# EasyEDA Pro project TeensySensorV6.1.eprj, board PCB1
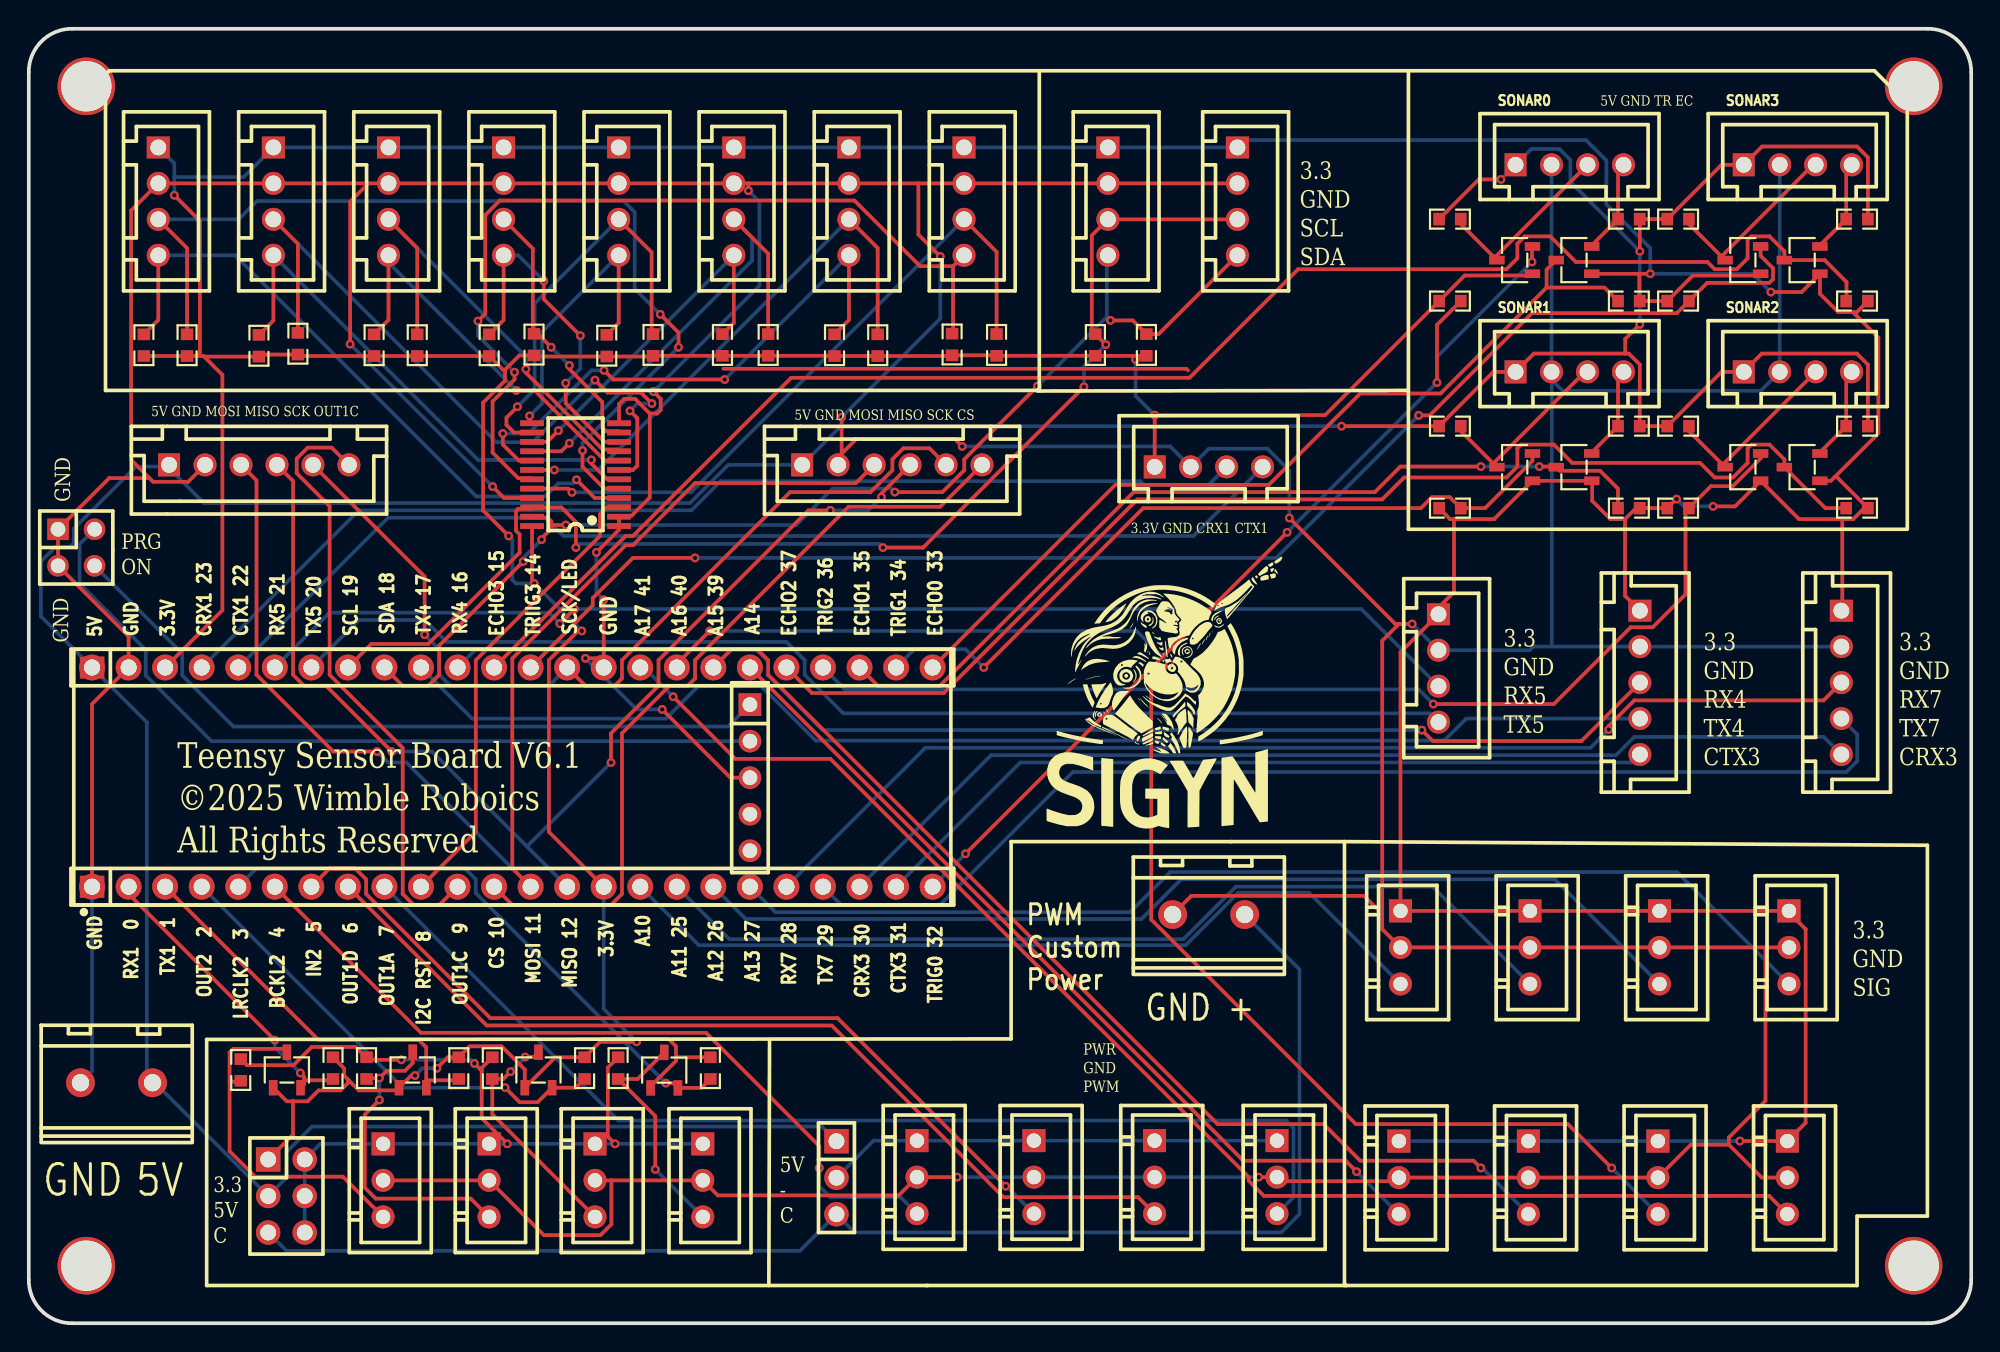
[diagram p5: board, top side]
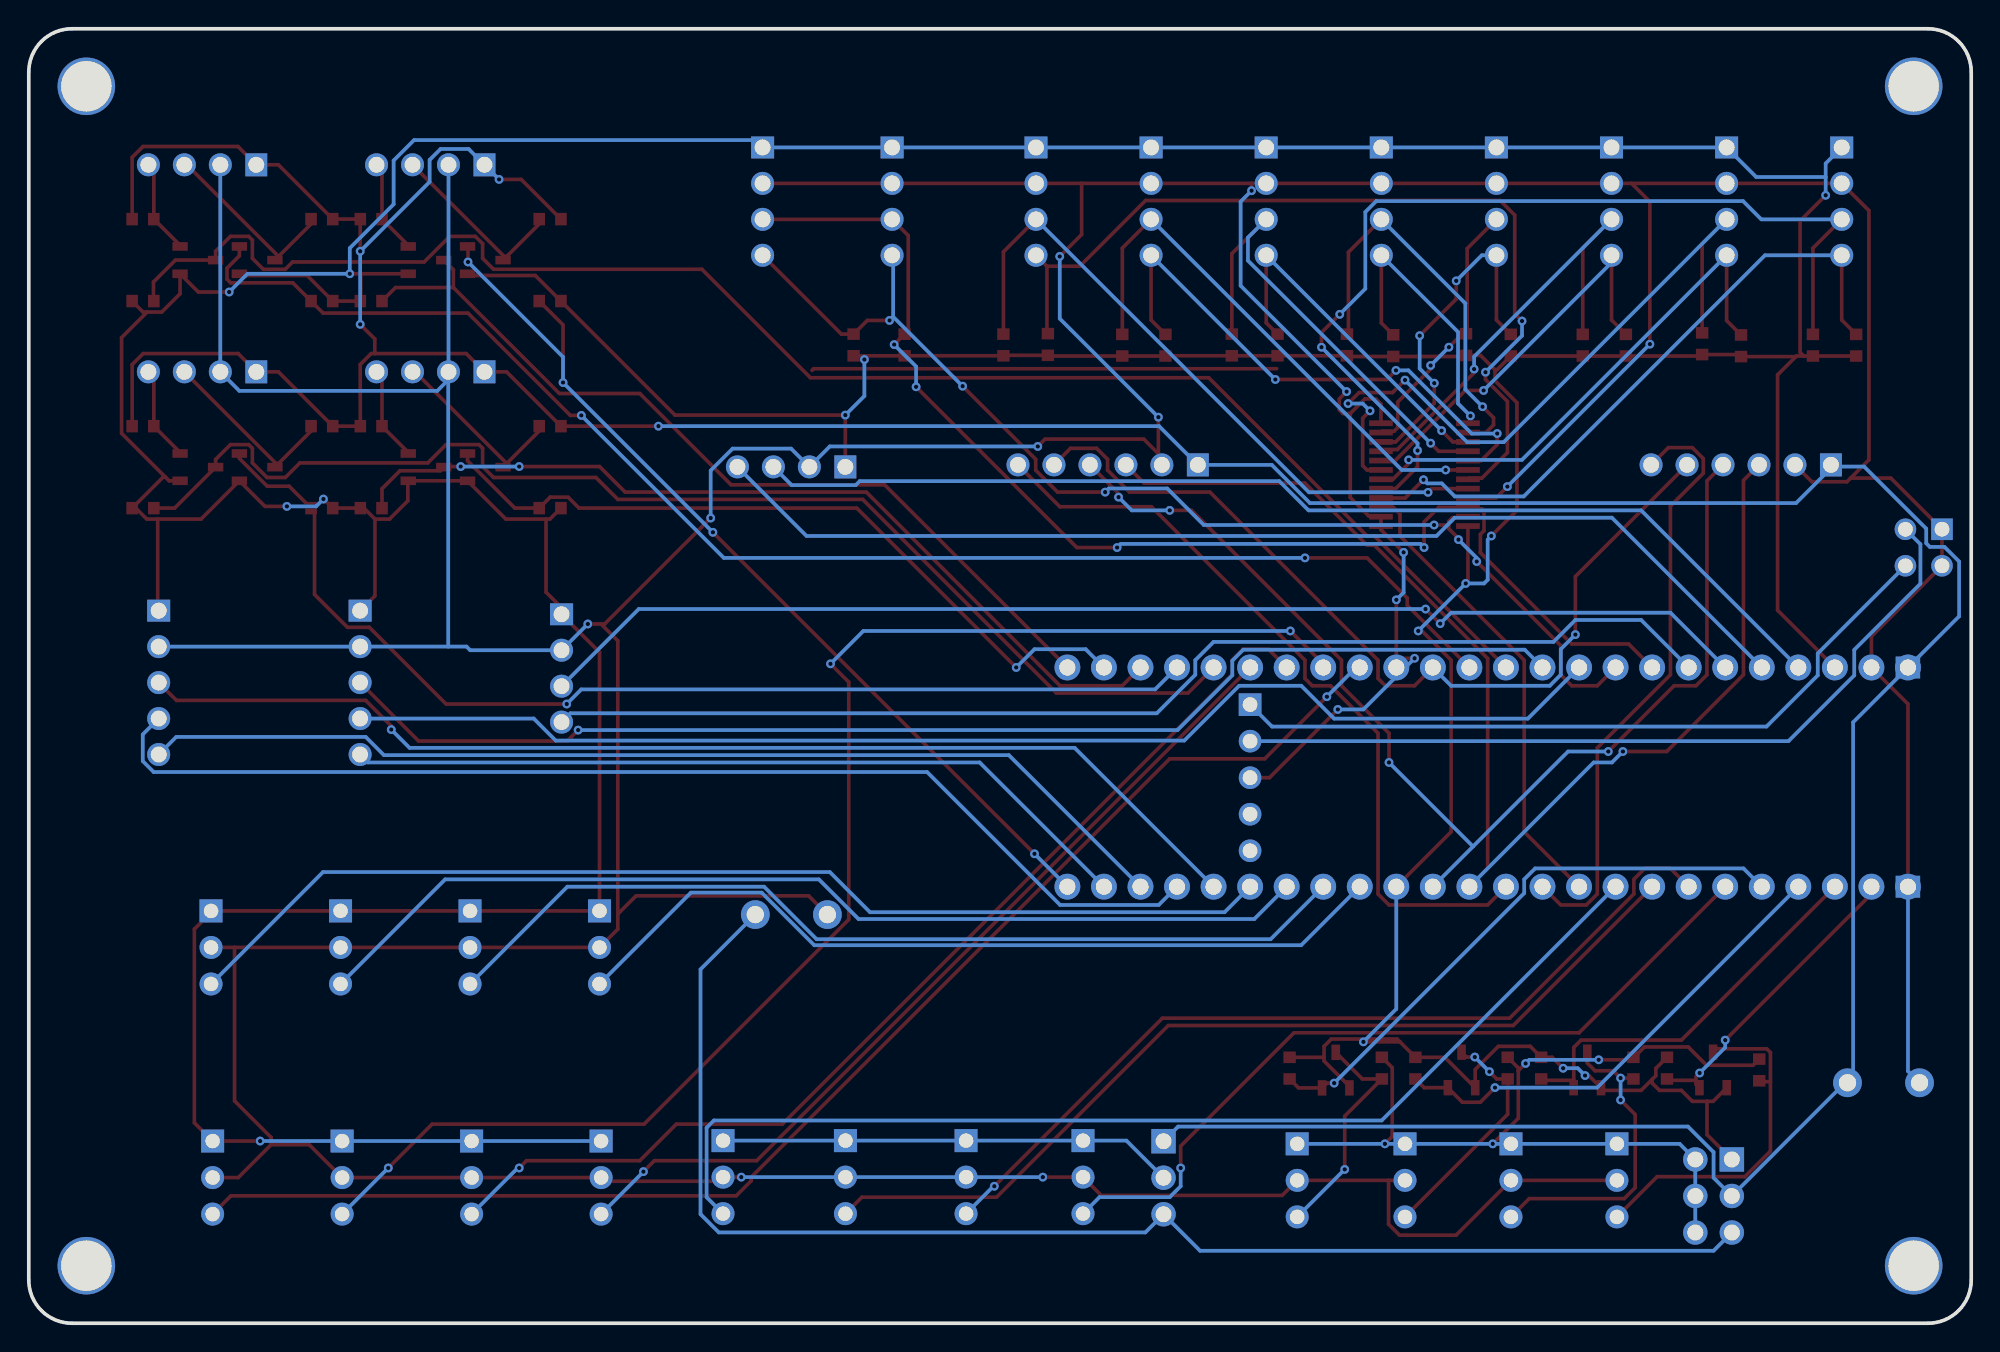
[diagram p6: board, bottom side, seen from below]

Outline 135 x 90 mm; copper layers: Top Layer, Inner1, Inner2, Bottom Layer. Coordinates in mm from the lower left corner of the outline.
Outline path: 0,87 0,3 arc(0.88,0.88) 3,0 132,0 arc(134.12,0.88) 135,3 135,87 arc(134.12,89.12) 132,90 3,90 arc(0.88,89.12) 0,87
Stack: Top Layer 0.035mm Outer layer thickness 1oz / Dielectric1 0.2104mm 7628 RC49% 8.6mil / Inner1 0.0152mm Inner layer thickness / Dielectric2 1.065mm 1.1mm H/HOZ Copper / Inner2 0.0152mm Inner layer thickness / Dielectric3 0.2104mm 7628 RC49% 8.6mil / Bottom Layer 0.035mm Outer layer thickness 1oz

## Design rules (mm)
template: JLCPCB Capability(Two Layers Board)
spacing copperThickness1oz (default): track to track 0.102, other pairs 0.152 to 0.3
spacing copperThickness2oz: track to track 0.203, other pairs 0.152 to 0.3
track width copperThickness1oz (default): min 0.127, default 0.254, max 2.54
track width copperThickness2oz: min 0.203, default 0.254, max 2.54
differential pair differentialPair (default): width min 0.127, default 0.254, max 2.54; gap min 0.152, default 0.152
via viaSize (default): diameter min 0.5, default 0.61, max 10; hole min 0.3, default 0.305, max 6.3

## Placement (name value [footprint] x y rotation side)
CN1  ZX-XH2.54-3PZZ  [CONN-TH_3P-P2.54_2501S-3P]  46.84 9.93 270 top
CN2  ZX-XH2.54-3PZZ  [CONN-TH_3P-P2.54_2501S-3P]  39.35 9.93 270 top
CN3  ZX-XH2.54-3PZZ  [CONN-TH_3P-P2.54_2501S-3P]  24.62 9.93 270 top
CN10  ZX-XH2.54-4PZZ  [CONN-TH_4P-P2.50_4PIN]  82 59.54 0 top
CN11  ZX-XH2.54-4PZZ  [CONN-TH_4P-P2.50_4PIN]  75 78 270 top
CN12  ZX-XH2.54-4PZZ  [CONN-TH_4P-P2.50_4PIN]  84 78 270 top
CN13  ZX-XH2.54-4PZZ  [CONN-TH_4P-P2.50_4PIN]  97.97 45.54 270 top
CN14  ZX-XH2.54-4PZZ  [CONN-TH_4P-P2.50_4PIN]  9 78 270 top
CN15  ZX-XH2.54-4PZZ  [CONN-TH_4P-P2.50_4PIN]  17 78 270 top
CN16  ZX-XH2.54-4PZZ  [CONN-TH_4P-P2.50_4PIN]  25 78 270 top
CN17  ZX-XH2.54-4PZZ  [CONN-TH_4P-P2.50_4PIN]  33 78 270 top
CN18  ZX-XH2.54-4PZZ  [CONN-TH_4P-P2.50_4PIN]  41 78 270 top
CN19  ZX-XH2.54-4PZZ  [CONN-TH_4P-P2.50_4PIN]  49 78 270 top
CN20  ZX-XH2.54-4PZZ  [CONN-TH_4P-P2.50_4PIN]  57 78 270 top
CN21  ZX-XH2.54-4PZZ  [CONN-TH_4P-P2.50_4PIN]  65 78 270 top
CN50  ZX-XH2.54-3PZZ  [CONN-TH_3P-P2.54_2501S-3P]  61.73 10.16 270 top
CN51  ZX-XH2.54-3PZZ  [CONN-TH_3P-P2.54_2501S-3P]  69.86 10.16 270 top
CN52  ZX-XH2.54-3PZZ  [CONN-TH_3P-P2.54_2501S-3P]  78.24 10.16 270 top
CN53  ZX-XH2.54-3PZZ  [CONN-TH_3P-P2.54_2501S-3P]  86.75 10.16 270 top
CN54  ZX-XH2.54-3PZZ  [CONN-TH_3P-P2.54_2501S-3P]  31.99 9.93 270 top
CN56  ZX-XH2.54-3PZZ  [CONN-TH_3P-P2.54_2501S-3P]  122.22 10.13 270 top
CN57  ZX-XH2.54-3PZZ  [CONN-TH_3P-P2.54_2501S-3P]  113.22 10.13 270 top
CN58  ZX-XH2.54-3PZZ  [CONN-TH_3P-P2.54_2501S-3P]  104.22 10.13 270 top
CN59  ZX-XH2.54-3PZZ  [CONN-TH_3P-P2.54_2501S-3P]  95.22 10.13 270 top
CN60  ZX-XH2.54-3PZZ  [CONN-TH_3P-P2.54_2501S-3P]  122.33 26.13 270 top
CN61  ZX-XH2.54-3PZZ  [CONN-TH_3P-P2.54_2501S-3P]  113.33 26.13 270 top
CN62  ZX-XH2.54-3PZZ  [CONN-TH_3P-P2.54_2501S-3P]  104.33 26.13 270 top
CN63  ZX-XH2.54-3PZZ  [CONN-TH_3P-P2.54_2501S-3P]  95.33 26.13 270 top
H1  PZ254V-11-03P  [HDR-TH_3P-P2.54-V-M]  56.13 10.12 270 top
H18  HX PZ2.54-2x2P ZZ  [HDR-TH_HX-PZ2.54-2X2P-ZZ]  3.3 53.93 270 top
P1  WJ127-5.0-2P  [CONN-TH_2P-P5.00_CPC3703CTR]  6.1 16.72 0 top
P2  WJ127-5.0-2P  [CONN-TH_2P-P5.00_CPC3703CTR]  82 28.41 0 top
Q1  BSS138  [SOT-23-3_L2.9-W1.6-P1.90-LS2.8-BR]  103.27 73.92 0 top
Q2  BSS138  [SOT-23-3_L2.9-W1.6-P1.90-LS2.8-BR]  107.39 73.92 0 top
Q3  BSS138  [SOT-23-3_L2.9-W1.6-P1.90-LS2.8-BR]  103.27 59.52 0 top
Q4  BSS138  [SOT-23-3_L2.9-W1.6-P1.90-LS2.8-BR]  107.39 59.52 0 top
Q5  BSS138  [SOT-23-3_L2.9-W1.6-P1.90-LS2.8-BR]  119.13 59.52 0 top
Q6  BSS138  [SOT-23-3_L2.9-W1.6-P1.90-LS2.8-BR]  123.25 59.52 0 top
Q7  BSS138  [SOT-23-3_L2.9-W1.6-P1.90-LS2.8-BR]  119.13 73.92 0 top
Q8  BSS138  [SOT-23-3_L2.9-W1.6-P1.90-LS2.8-BR]  123.25 73.92 0 top
Q16  BSS138  [SOT-23-3_L2.9-W1.6-P1.90-LS2.8-BR]  44.17 17.6 270 top
Q19  BSS138  [SOT-23-3_L2.9-W1.6-P1.90-LS2.8-BR]  35.42 17.61 270 top
Q20  BSS138  [SOT-23-3_L2.9-W1.6-P1.90-LS2.8-BR]  26.68 17.61 270 top
Q21  BSS138  [SOT-23-3_L2.9-W1.6-P1.90-LS2.8-BR]  17.94 17.61 270 top
R1  3kΩ  [R0603]  8 68 90 top
R2  3kΩ  [R0603]  11 68 90 top
R3  3kΩ  [R0603]  16 67.96 90 top
R4  3kΩ  [R0603]  18.7 68.1 90 top
R5  3kΩ  [R0603]  24 68 90 top
R6  3kΩ  [R0603]  27 68 90 top
R7  3kΩ  [R0603]  32 68 90 top
R8  3kΩ  [R0603]  35.11 68.04 90 top
R9  3kΩ  [R0603]  67.26 68.02 270 top
R10  3kΩ  [R0603]  64.17 68.05 270 top
R11  3kΩ  [R0603]  59 68 270 top
R12  3kΩ  [R0603]  56 68 270 top
R13  3kΩ  [R0603]  51.39 68.02 270 top
R14  3kΩ  [R0603]  48.21 68.02 270 top
R15  3kΩ  [R0603]  43.39 68.02 270 top
R16  3kΩ  [R0603]  40.17 67.97 270 top
R17  3kΩ  [R0603]  74.13 68.01 270 top
R18  3kΩ  [R0603]  77.68 68.02 270 top
R19  10kΩ  [R0603]  98.77 76.77 0 top
R20  10kΩ  [R0603]  98.77 71.07 0 top
R21  10kΩ  [R0603]  111.21 76.77 0 top
R22  10kΩ  [R0603]  111.21 71.07 0 top
R23  10kΩ  [R0603]  98.77 62.37 0 top
R24  10kΩ  [R0603]  98.77 56.67 0 top
R25  10kΩ  [R0603]  111.21 62.37 0 top
R26  10kΩ  [R0603]  111.21 56.67 0 top
R27  10kΩ  [R0603]  114.63 62.37 0 top
R28  10kΩ  [R0603]  114.63 56.67 0 top
R29  10kΩ  [R0603]  127.06 62.37 0 top
R30  10kΩ  [R0603]  127.06 56.67 0 top
R31  10kΩ  [R0603]  114.63 76.77 0 top
R32  10kΩ  [R0603]  114.63 71.07 0 top
R33  10kΩ  [R0603]  127.06 76.77 0 top
R34  10kΩ  [R0603]  127.06 71.07 0 top
R39  10kΩ  [R0603]  47.37 17.74 90 top
R40  10kΩ  [R0603]  40.96 17.74 90 top
R41  10kΩ  [R0603]  38.63 17.74 90 top
R42  10kΩ  [R0603]  32.22 17.74 90 top
R43  10kΩ  [R0603]  29.89 17.74 90 top
R44  10kΩ  [R0603]  23.47 17.74 90 top
R45  10kΩ  [R0603]  21.14 17.74 90 top
R46  10kΩ  [R0603]  14.73 17.61 90 top
SONAR0  ZX-XH2.54-4PZZ  [CONN-TH_4P-P2.50_4PIN]  107.08 80.54 0 top
SONAR1  ZX-XH2.54-4PZZ  [CONN-TH_4P-P2.50_4PIN]  107.08 66.15 0 top
SONAR2  ZX-XH2.54-4PZZ  [CONN-TH_4P-P2.50_4PIN]  122.94 66.15 0 top
SONAR3  ZX-XH2.54-4PZZ  [CONN-TH_4P-P2.50_4PIN]  122.94 80.54 0 top
U1  Teensy USB Board, Version 4.1  [COMM-TH_L61.0-W17.8-P2.54]  33.61 37.97 0 top
U2  TCA9548APWR  [TSSOP-24_L7.8-W4.4-P0.65-LS6.4-BL]  38 59 90 top
U4  ZX-XH2.54-6PZZ  [CONN-TH_6P-P2.50_ZX-XH2.54-6PZZ]  60 59.68 180 top
U5  ZX-XH2.54-5PZZ  [CONN-TH_5P-P2.50_ZX-XH2.54-5PZZ]  125.97 44.54 270 top
U6  ZX-XH2.54-5PZZ  [CONN-TH_5P-P2.50_ZX-XH2.54-5PZZ]  111.97 44.54 270 top
U8  ZX-XH2.54-6PZZ  [CONN-TH_6P-P2.50_ZX-XH2.54-6PZZ]  16 59.68 180 top
U12  -  [3.5mm_Hole#2]  133.83 -4.84 0 top
U13  -  [3.5mm_Hole]  150.72 79.12 0 top
U14  -  [3.5mm_Hole#3]  -7.02 56.33 0 top
U15  -  [3.5mm_Hole#4]  -7.02 -9.71 0 top
U19  BX-PZ2.54-2-3PZZ  [HDR-TH_6P-P2.54-V-M-R2-C3-S2.54]  17.91 8.85 270 top
U43  HC-PM254-8.5H-1x24PZ  [HDR-TH_24P-P2.54-V-F]  33.61 45.59 0 top
U44  HC-PM254-8.5H-1x24PZ  [HDR-TH_24P-P2.54-V-F]  33.61 30.35 0 top
U48  PM2.54-1*5  [HDR-TH_5P-P2.54-V-F]  50.12 37.93 270 top

## Footprints (pads in the part's own frame, mm; a bottom-side part is the same pattern mirrored in y, then rotated)
3.5mm_Hole
  round 4 hole 3.5: 3(-19.717,6.877)
3.5mm_Hole#2
  round 4 hole 3.5: 3(-2.826,8.841)
3.5mm_Hole#3
  round 4 hole 3.5: 3(11.017,29.674)
3.5mm_Hole#4
  round 4 hole 3.5: 3(11.017,13.714)
COMM-TH_L61.0-W17.8-P2.54
  round 1.8 hole 1.1: 1(-29.21,-7.62) 2(-26.67,-7.62) 3(-24.13,-7.62) 4(-21.59,-7.62) 5(-19.05,-7.62) 6(-16.51,-7.62) 7(-13.97,-7.62) 8(-11.43,-7.62) 9(-8.89,-7.62) 10(-6.35,-7.62) 11(-3.81,-7.62) 12(-1.27,-7.62) 13(1.27,-7.62) 14(3.81,-7.62) 15(6.35,-7.62) 16(8.89,-7.62) 17(11.43,-7.62) 18(13.97,-7.62) 19(16.51,-7.62) 20(19.05,-7.62) 21(21.59,-7.62) 22(24.13,-7.62) 23(26.67,-7.62) 24(29.21,-7.62) 25(29.21,7.62) 26(26.67,7.62) 27(24.13,7.62) 28(21.59,7.62) 29(19.05,7.62) 30(16.51,7.62) 31(13.97,7.62) 32(11.43,7.62) 33(8.89,7.62) 34(6.35,7.62) 35(3.81,7.62) 36(1.27,7.62) 37(-1.27,7.62) 38(-3.81,7.62) 39(-6.35,7.62) 40(-8.89,7.62) 41(-11.43,7.62) 42(-13.97,7.62) 43(-16.51,7.62) 44(-19.05,7.62) 45(-21.59,7.62) 46(-24.13,7.62) 47(-26.67,7.62) 48(-29.21,7.62)
CONN-TH_2P-P5.00_CPC3703CTR
  round 2 hole 1.2: 1(-2.505,0) 2(2.505,0)
CONN-TH_3P-P2.54_2501S-3P
  rect 1.6x1.6 hole 1: 1(-2.54,0)
  round 1.6 hole 1: 2(0,0) 3(2.54,0)
CONN-TH_4P-P2.50_4PIN
  rect 1.524x1.6 hole 1.1: 1(-3.75,0)
  round 1.6 hole 1.1: 2(-1.25,0) 3(1.25,0) 4(3.75,0)
CONN-TH_5P-P2.50_ZX-XH2.54-5PZZ
  rect 1.524x1.6 hole 1.1: 1(-5,0)
  round 1.6 hole 1.1: 2(-2.5,0) 3(0,0) 4(2.5,0) 5(5,0)
CONN-TH_6P-P2.50_ZX-XH2.54-6PZZ
  rect 1.524x1.6 hole 1.1: 1(6.25,0)
  round 1.6 hole 1.1: 2(3.75,0) 3(1.25,0) 4(-1.25,0) 5(-3.75,0) 6(-6.25,0)
HDR-TH_3P-P2.54-V-M
  rect 1.7x1.7 hole 1.1: 1(-2.54,0)
  round 1.7 hole 1.1: 2(0,0) 3(2.54,0)
HDR-TH_5P-P2.54-V-F
  rect 1.575x1.575 hole 1.02: 1(-5.08,0)
  round 1.575 hole 1.02: 2(-2.54,0) 3(0,0) 4(2.54,0) 5(5.08,0)
HDR-TH_6P-P2.54-V-M-R2-C3-S2.54
  rect 1.7x1.7 hole 1.1: 1(-2.54,-1.27)
  round 1.7 hole 1.1: 2(-2.54,1.27) 3(0,-1.27) 4(0,1.27) 5(2.54,-1.27) 6(2.54,1.27)
HDR-TH_24P-P2.54-V-F
  rect 1.7x1.524 hole 1.1: 1(-29.21,0)
  round 1.7 hole 1.1: 2(-26.67,0) 3(-24.13,0) 4(-21.59,0) 5(-19.05,0) 6(-16.51,0) 7(-13.97,0) 8(-11.43,0) 9(-8.89,0) 10(-6.35,0) 11(-3.81,0) 12(-1.27,0) 13(1.27,0) 14(3.81,0) 15(6.35,0) 16(8.89,0) 17(11.43,0) 18(13.97,0) 19(16.51,0) 20(19.05,0) 21(21.59,0) 22(24.13,0) 23(26.67,0) 24(29.21,0)
HDR-TH_HX-PZ2.54-2X2P-ZZ
  rect 1.5x1.5 hole 1.02: 1(-1.27,-1.27)
  round 1.5 hole 1.02: 2(-1.27,1.27) 3(1.27,-1.27) 4(1.27,1.27)
R0603
  rect 0.806x0.864 smd: 1(-0.753,0) 2(0.753,0)
SOT-23-3_L2.9-W1.6-P1.90-LS2.8-BR
  rect 1.07x0.6 smd: 1(1.235,-0.95) 2(1.235,0.95) 3(-1.235,0)
TSSOP-24_L7.8-W4.4-P0.65-LS6.4-BL
  rect 0.4x1.65 smd: 1(-3.575,-3.022) 2(-2.925,-3.022) 3(-2.275,-3.022) 4(-1.625,-3.022) 5(-0.975,-3.022) 6(-0.325,-3.022) 7(0.325,-3.022) 8(0.975,-3.022) 9(1.625,-3.022) 10(2.275,-3.022) 11(2.925,-3.022) 12(3.575,-3.022) 13(3.575,3.022) 14(2.925,3.022) 15(2.275,3.022) 16(1.625,3.022) 17(0.975,3.022) 18(0.325,3.022) 19(-0.325,3.022) 20(-0.975,3.022) 21(-1.625,3.022) 22(-2.275,3.022) 23(-2.925,3.022) 24(-3.575,3.022)

## Nets
As in the schematic.

Pads without a net: U12 3; U13 3; U14 3; U15 3; U48 4 5

## Via types
v1: diameter 0.61, hole 0.305, Top Layer to Bottom Layer, 110 vias

## Routing (per net, layer and track width the routed paths; a pad name or vN(x,y) marks a point on that pad's centre or on a via; arc(x,y) is an arc through that point)
3.3V: length 567.9
  Top Layer w0.254: v1(121.07,71.7) 123.22,71.7 Q8.1 124.49,71.58 125.75,70.31 126.77,70.31 ; U5.1 126.04,49.61 126.04,55.91 ; 99.05,55.91 98.78,55.91 R24.1 ; 99.05,55.91 101.84,55.91 Q3.1 Q4.1 108.66,58.54 108.66,57.18 109.93,55.91 110.94,55.91 ; 99.05,55.91 99.05,50.83 98.03,49.81 98.03,49.36 95.33,46.65 CN63.1 CN62.1 CN61.1 122.22,28.67 ; 39.7,19.56 R41.2 36.59,18.49 Q19.1 34.47,17.65 32.87,19.25 30.65,19.25 R43.2 29.12,18.49 v1(28.36,17.73) ; 39.7,19.56 v1(42.24,19.56) ; 39.7,19.56 39.9,19.76 44.47,19.76 44.98,19.25 44.98,18.49 ; 44.98,18.49 R39.2 ; 44.98,18.49 44.98,18.24 43.22,16.47 Q16.1 ; v1(35.13,51.43) 34.98,51.59 U2.24 ; v1(26.84,17.22) 26.58,17.22 Q20.1 25.55,16.19 22.94,16.19 22.17,16.95 ; R45.2 21.92,17.71 21.92,17.21 22.17,16.95 ; 76.92,67.26 77.67,67.26 ; 76.92,67.26 v1(76.92,67.01) ; 76.92,67.26 R17.2 ; 111.93,72.97 Q2.1 ; 111.93,72.97 v1(112.69,72.97) ; 111.93,72.97 111.93,71.1 R22.2 R32.1 115.65,72.84 120.24,72.84 Q7.1 ; 22.17,16.95 22.17,16.7 21.67,16.19 20.14,16.19 19.38,15.43 18.36,15.43 ; 18.36,15.43 17.94,15.43 Q21.1 ; 18.36,15.43 18.36,13.11 U19.1 ; U1.46 13.46,49.57 13.46,65.94 12.19,67.21 ; 126.04,55.91 123.03,55.91 Q5.1 118.59,56.79 v1(117.06,56.79) ; 126.04,55.91 126.8,55.91 127.56,56.67 R30.2 125.66,58.83 125.5,58.83 ; Q1.1 104.38,72.84 99.79,72.84 R20.1 90.09,63.14 v1(78.25,63.14) CN10.1 ; 11.64,67.25 12.15,67.25 12.19,67.21 ; 11.64,67.25 R2.1 R1.1 ; 11.64,67.25 11.89,67.5 11.89,76.64 v1(10.12,78.42) ; v1(38.43,48.13) 38.18,48.13 36.15,46.1 36.15,34.16 U1.15 ; 33.1,66.29 34.1,67.29 R8.1 35.19,67.21 R16.2 43.34,67.21 R15.2 R14.2 R13.2 55.98,67.26 R12.2 R11.2 64.12,67.25 R10.2 67.23,67.3 R9.2 74.13,67.26 ; 33.1,66.29 33.1,65.53 31.58,64.01 31.58,56.51 v1(33.35,54.74) ; 33.1,66.29 32.95,66.29 R7.1 R6.1 R5.1 18.81,67.25 R4.1 16.14,67.35 16,67.21 12.19,67.21 ; 122.22,28.67 CN60.1 ; 122.22,28.67 123.49,27.4 123.49,13.94 CN56.1 v1(118.92,12.67) ; 110.94,55.91 110.94,50.57 U6.1 ; 110.94,55.91 111.7,56.67 R26.2 R28.1 114.5,57.3 v1(114.52,57.3) ; 125.5,58.83 125.25,58.57 Q6.1 ; 125.5,58.83 128.55,61.87 128.55,68.53 126.77,70.31 ; 126.77,70.31 127.05,70.31 R34.2
  Bottom Layer w0.254: v1(10.12,78.42) 10.12,79.69 ; 10.12,79.69 14.94,79.69 CN15.1 CN16.1 CN17.1 CN18.1 CN19.1 CN20.1 CN21.1 CN11.1 CN12.1 84.51,82.26 108.23,82.26 109.64,80.84 109.64,77.79 112.69,74.74 v1(112.69,72.97) 119.8,72.97 v1(121.07,71.7) ; 10.12,79.69 10.12,80.63 CN14.1 ; v1(26.84,17.22) 27.35,17.73 v1(28.36,17.73) ; v1(78.25,63.14) 76.92,64.47 v1(76.92,67.01) ; v1(33.35,54.74) 33.61,54.48 33.61,51.69 33.86,51.43 v1(35.13,51.43) v1(38.43,48.13) ; v1(117.06,56.79) 115.03,56.79 v1(114.52,57.3) ; v1(118.92,12.67) CN57.1 CN58.1 CN59.1 ; U1.15 39.96,21.85 v1(42.24,19.56)
5V: length 293
  Top Layer w0.254: R29.2 127.82,66.65 127.05,67.42 120.44,67.42 119.18,66.15 ; v1(111.97,69.45) 110.95,68.43 110.95,67.42 ; 119.18,66.15 SONAR2.1 ; 119.18,66.15 117.65,66.15 R27.1 R25.2 111.97,66.66 111.21,67.42 110.95,67.42 ; v1(102.31,79.53) 100.78,79.53 R19.1 ; v1(111.97,74.53) 111.97,76.76 R21.2 R31.1 117.65,80.54 SONAR3.1 120.46,81.81 127.06,81.81 127.82,81.06 R33.2 ; 110.95,67.42 104.6,67.42 SONAR1.1 101.79,66.15 R23.1 v1(91.24,62.37)
  Bottom Layer w0.254: 9.63,59.56 12.17,57.02 45.96,57.02 48.61,59.68 U4.1 56.44,62.37 v1(91.24,62.37) ; 9.63,59.56 U8.1 ; 9.63,59.56 7.44,59.56 3.13,55.24 3.13,54.23 2.87,53.97 1.86,53.97 0.84,52.96 0.84,49.15 U1.48 8.21,41.78 8.21,17.11 P1.2 8.76,16.72 U19.3 17.91,10.12 17.91,11.9 19.69,13.67 55.12,13.67 H1.1 ; v1(102.31,79.53) SONAR0.1 104.43,81.64 106.38,81.64 107.14,80.88 107.14,79.36 v1(111.97,74.53) v1(111.97,69.45)
GND: length 594.5
  Top Layer w0.254: 50.02,79.25 CN20.2 61.83,79.25 ; 50.02,79.25 v1(50.02,78.74) ; 50.02,79.25 CN19.2 CN18.2 CN17.2 CN16.2 23.6,79.25 ; 120.7,26.13 CN61.2 CN62.2 CN63.2 94.06,27.4 94.06,28.45 ; 120.7,26.13 120.7,15.46 118.16,12.92 118.16,12.41 ; 120.7,26.13 CN60.2 ; 40.49,9.93 CN2.2 ; 40.49,9.93 40.49,6.89 39.73,6.12 35.8,6.12 CN54.2 CN3.2 ; 40.49,9.93 CN1.2 47.89,8.89 60.46,8.89 CN50.2 v1(64.53,10.16) ; 8.38,58.76 7.11,60.03 7.11,77.36 CN14.2 CN15.2 23.6,79.25 ; 8.38,58.76 5.59,58.76 H18.1 H18.3 6.94,47.76 U1.47 4.4,43.05 U1.1 ; 8.38,58.76 8.64,58.5 11.08,58.5 U8.2 ; 56.49,60.45 56.49,59.92 U4.2 ; 56.49,60.45 v1(56.49,62.99) ; 56.49,60.45 57.51,61.47 64.37,61.47 v1(64.87,60.96) ; 23.6,79.25 22.33,77.98 v1(22.33,68.07) ; 61.83,79.25 CN21.2 CN11.2 CN12.2 ; 61.83,79.25 61.83,75.69 v1(63.35,74.17) ; 43.16,63.25 42.14,64.26 41.38,64.26 41.02,63.91 U2.12 ; 43.16,63.25 43.16,57.41 41.89,56.14 41.08,56.14 U2.2 U2.1 41.02,55.17 v1(39.45,53.6) ; 43.16,63.25 43.67,63.25 43.92,63.5 43.92,64.26 v1(43.41,64.77) ; 95.23,48.62 v1(96.15,48.62) ; 95.23,48.62 94.97,48.62 v1(87.61,55.98) ; 95.23,48.62 94.06,47.45 94.06,28.45 ; U48.3 48.77,37.93 v1(44.02,42.68) ; 118.16,12.41 115.51,12.41 CN57.2 CN58.2 CN59.2 94.97,9.87 87.03,9.87 CN53.2 v1(85.48,10.16) ; 118.16,12.41 120.44,10.13 CN56.2 ; 94.06,28.45 92.79,29.72 80.8,29.72 P2.1 ; 39.96,46.23 U1.34 ; 39.96,46.23 v1(38.69,46.23) ; 39.96,46.23 v1(39.96,50.3) ; U2.21 33.03,57.38 v1(32.24,58.17)
  Bottom Layer w0.254: 105.85,65.59 105.85,66.13 SONAR1.2 SONAR0.2 ; 105.85,65.59 105.85,47.05 ; 105.85,65.59 106.61,64.83 120.37,64.83 SONAR2.2 SONAR3.2 ; v1(22.33,68.07) v1(32.24,58.17) ; 105.85,47.05 104.58,47.05 104.32,46.79 CN13.2 v1(96.15,48.62) ; 105.85,47.05 111.97,47.05 ; v1(87.61,55.98) 87.61,59.29 86.08,60.81 82.02,60.81 CN10.2 79.33,60.96 v1(64.87,60.96) ; v1(43.41,64.77) 50.78,72.14 50.78,77.98 v1(50.02,78.74) ; v1(56.49,62.99) 63.35,69.85 v1(63.35,74.17) ; v1(38.69,46.23) 42.24,42.68 v1(44.02,42.68) ; P1.1 4.4,17.53 U1.1 ; v1(85.48,10.16) CN52.2 CN51.2 v1(64.53,10.16) ; v1(39.45,53.6) 39.45,50.8 v1(39.96,50.3) ; U6.2 U5.2
A10: length 58.7
  Bottom Layer w0.254: 95.33,23.59 88.98,29.94 84.06,29.94 80.4,26.28 46.57,26.28 U1.16
A11: length 65.1
  Bottom Layer w0.254: U1.17 48.69,26.7 80.24,26.7 83.9,30.35 97.57,30.35 104.33,23.59
A12: length 70.8
  Bottom Layer w0.254: 113.33,23.59 106.06,30.86 80.09,30.86 77.33,28.1 49.83,28.1 U1.18
A13: length 77.3
  Bottom Layer w0.254: U1.19 51.9,28.57 76.53,28.57 79.33,31.37 114.55,31.37 122.33,23.59
A14: length 60.9
  Top Layer w0.254: v1(92.28,10.54) 91.52,11.3 84.41,11.3 U1.30
  Bottom Layer w0.254: CN59.3 92.28,10.53 v1(92.28,10.54)
A15: length 74
  Top Layer w0.254: U1.31 48.85,46.86 50.62,46.86 51.39,46.1 51.39,45.08 82.63,13.84 90,13.84 92.53,11.3 100.41,11.3 v1(100.92,10.79)
  Bottom Layer w0.254: CN58.3 101.01,10.79 v1(100.92,10.79)
A16: length 98.4
  Top Layer w0.254: v1(47.32,48.13) 45.04,45.85 U1.32 ; v1(110.01,10.79) 106.97,13.84 92.23,13.84 78.01,28.07 78.01,44.58 v1(79.28,45.85)
  Bottom Layer w0.254: v1(110.01,10.79) CN57.3 ; v1(47.32,48.13) 76.99,48.13 v1(79.28,45.85)
A17: length 95.6
  Top Layer w0.254: v1(44.78,43.56) 49.1,39.24 55.71,39.24 84.79,10.16 84.79,9.91 85.84,8.86 120.95,8.86 CN56.3
  Bottom Layer w0.254: U1.33 42.75,45.59 v1(44.78,43.56)
BCLK2: length 55.7
  Top Layer w0.254: U1.6 27.26,20.19 47.07,20.19 54.94,12.32 v1(54.94,10.79)
  Bottom Layer w0.254: v1(54.94,10.79) 54.94,9.52 55.71,8.76 60.59,8.76 CN50.3
CRX1: length 77.2
  Bottom Layer w0.254: CN10.3 81.98,58.27 77.53,58.27 77.25,58.55 48.08,58.55 46.05,56.51 22.94,56.51 U1.45
CRX3: length 73.1
  Bottom Layer w0.254: U1.22 66.88,39.5 110.31,39.5 111.59,40.77 124.75,40.77 U5.5
CS: length 54.4
  Top Layer w0.254: U4.6 63.34,56.77 56.97,56.77 46.31,46.1 46.31,44.83 45.8,44.32 44.53,44.32 41.23,41.02 41.23,29.84 40.47,29.08 33.61,29.08 U1.12
CTX1: length 78
  Bottom Layer w0.254: U1.44 24.97,56.01 35.89,56.01 37.16,54.74 80.95,54.74 CN10.4
CTX3: length 55.5
  Bottom Layer w0.254: U1.23 68.91,38.99 111.42,38.99 U6.5
ECHO0: length 61.2
  Top Layer w0.254: 105.49,72.01 98.12,64.64 92.53,64.64 86.19,58.29 75.52,58.29 U1.25 ; 105.49,72.01 105.49,73.25 Q2.3 ; 105.49,72.01 109.51,72.01 R22.1
ECHO1: length 61.5
  Top Layer w0.254: v1(104.98,59.56) 106.12,59.56 Q4.3 106.41,59.27 109.21,59.27 110.45,58.02 R26.1 ; U1.27 59.01,44.32 63.32,44.32 76.79,57.78 93.55,57.78 95.33,59.56 v1(100.92,59.56)
  Bottom Layer w0.254: v1(100.92,59.56) v1(104.98,59.56)
ECHO2: length 86.9
  Top Layer w0.254: R30.1 124.86,56.67 Q6.3 122.01,60.05 120.98,61.09 119.71,61.09 119.46,60.83 119.46,59.82 118.44,58.8 117.17,58.8 116.16,59.82 107.27,59.82 106,61.09 103.71,61.09 103.46,60.83 103.46,59.56 102.69,58.8 95.58,58.8 94.06,57.28 77.04,57.28 63.58,43.81 54.44,43.81 U1.29
ECHO3: length 112.7
  Top Layer w0.254: R34.1 126.33,71.09 126.33,72.39 124.81,73.92 Q8.3 122.01,74.53 120.98,75.56 119.71,75.56 119.46,75.31 119.46,74.04 118.7,73.28 117.17,73.28 116.66,73.79 107.52,73.79 105.74,75.56 103.97,75.56 103.46,75.06 103.46,74.04 102.69,73.28 88.22,73.28 80.67,65.74 52.99,65.74 41.99,54.74 41.48,54.74 U1.37
I2CRESET: length 32.6
  Top Layer w0.254: U2.3 40.17,56.72 39.7,56.26 39.7,54.74 31.07,46.1 31.07,34.16 U1.10
IN2: length 61.3
  Top Layer w0.254: v1(67.9,9.52) 56.21,21.21 32.08,21.21 23.45,29.84 23.45,30.86 22.69,31.62 20.91,31.62 U1.7
  Bottom Layer w0.254: CN51.3 67.95,9.52 v1(67.9,9.52)
LRCLK2: length 40.5
  Top Layer w0.254: R39.1 46.75,16.36 Q16.2 44.78,16.69 v1(44.28,16.69)
  Bottom Layer w0.254: v1(44.28,16.69) 31.07,29.9 31.07,30.86 30.31,31.62 15.83,31.62 U1.5
MISO: length 80.2
  Top Layer w0.254: v1(25.22,39.75) 20.65,44.32 19.13,44.32 18.37,45.08 18.37,58.56 U8.4 ; v1(55.71,56.51) 54.18,56.51 43.77,46.1 43.77,44.32 40.47,41.02 v1(40.47,38.99) ; U4.4 59.26,57.69 v1(59.26,57.44)
  Bottom Layer w0.254: v1(55.71,56.51) 58.34,56.51 v1(59.26,57.44) ; v1(25.22,39.75) 28.02,39.75 34.62,33.15 ; 34.62,33.15 v1(40.47,38.99) ; 34.62,33.15 U1.14
MOSI: length 87.3
  Top Layer w0.254: U1.13 33.61,31.62 33.61,46.22 41.48,54.09 41.99,54.09 46.31,58.41 57.48,58.41 U4.3 ; v1(24.21,39.75) 21.16,39.75 15.83,45.08 15.83,58.6 U8.3
  Bottom Layer w0.254: U1.13 26.24,38.99 24.97,38.99 v1(24.21,39.75)
ON_OFF: length 51.7
  Bottom Layer w0.254: U48.1 48.6,41.49 14.22,41.49 10.67,45.04 10.67,46.57 H18.4
OUT1A: length 76.6
  Bottom Layer w0.254: CN53.3 87.89,8.76 87.89,13.59 87.38,14.1 40.97,14.1 U1.9
OUT1C: length 42.4
  Top Layer w0.254: U1.11 28.53,29.08 26.75,29.08 25.99,29.84 25.99,40 20.91,45.08 20.91,56.81 18.62,59.1 18.62,60.11 19.38,60.88 21.05,60.88 U8.6
OUT1D: length 65.5
  Top Layer w0.254: CN52.3 77.1,8.76 67.74,8.76 55.8,20.7 31.83,20.7 U1.8
OUT2: length 33.5
  Top Layer w0.254: v1(33.1,16.38) 34.11,15.37 35.36,15.37 Q19.2 38.02,16.38 R41.1
  Bottom Layer w0.254: v1(33.1,16.38) 25.99,16.38 U1.4
PROGRAM: length 56.4
  Bottom Layer w0.254: U48.2 12.7,40.47 8.13,45.04 8.13,46.82 3.53,51.42 3.53,54.16 H18.2
RX1: length 21.2
  Top Layer w0.254: 19.13,16.89 19.13,16.62 Q21.2 ; 19.13,16.89 21.05,16.89 R45.1 ; 19.13,16.89 19.13,17.14 v1(18.88,17.4) ; U1.2 6.94,29.84 v1(17.1,19.68)
  Bottom Layer w0.254: v1(17.1,19.68) 17.1,19.18 v1(18.88,17.4)
RX4: length 87.6
  Top Layer w0.254: v1(96.82,41.24) 97.58,40.48 107.91,40.48 U6.3
  Bottom Layer w0.254: v1(96.82,41.24) 55.16,41.24 51.35,45.05 51.35,46.07 50.59,46.83 31.03,46.83 U1.38
RX5: length 85.4
  Top Layer w0.254: v1(36.91,48.64) v1(37.92,49.66)
  Bottom Layer w0.254: v1(37.92,49.66) 92.61,49.66 CN13.3 ; U1.43 20.91,49.4 36.15,49.4 v1(36.91,48.64)
RX7: length 79.3
  Top Layer w0.254: v1(109.81,41.27) 109.81,41.53 111.59,43.31 124.74,43.31 U5.3
  Bottom Layer w0.254: v1(109.81,41.27) 108.54,40 62.31,40 U1.20
SCK: length 63.3
  Top Layer w0.254: U1.35 38.69,44.32 40.72,44.32 41.23,44.83 41.23,46.1 52.91,57.78 58.5,57.78 60.02,59.31 60.02,60.07 60.78,60.83 62.6,60.83 U4.5 ; v1(27.51,47.88) 27.51,51.92 U8.5
  Bottom Layer w0.254: U1.35 36.15,44.32 29.29,44.32 28.53,45.08 28.53,46.86 v1(27.51,47.88)
SCL: length 87
  Top Layer w0.254: v1(59.36,53.93) 62.16,53.93 v1(73.33,65.11) ; U1.41 23.81,47.23 27.77,47.23 34.11,53.58 34.11,54.85 33.86,55.1 33.86,56.48 34.01,56.62 34.88,56.62 U2.22 37.01,56.72 38.03,55.71 v1(38.03,53.93) ; v1(74.86,68.04) R17.1 73.88,69.02 73.88,75.63 CN11.3 CN12.3
  Bottom Layer w0.254: v1(59.36,53.93) 59.11,54.19 38.28,54.19 v1(38.03,53.93) ; v1(74.86,68.04) 73.33,66.52 v1(73.33,65.11)
SDA: length 81.4
  Top Layer w0.254: v1(60.19,57.78) 63.49,57.78 65.02,59.31 65.02,60.07 v1(70.1,65.15) ; v1(34.37,52.96) 28.53,47.12 28.53,45.08 27.77,44.32 25.99,44.32 U1.40 ; 36.32,55.5 v1(37.33,55.5) ; 36.32,55.5 36.32,55.75 36.06,56.01 35.05,56.01 U2.23 ; 36.32,55.5 36.32,55.24 35.64,54.57 v1(35.64,54.48) ; v1(75.18,69.72) 76.72,69.72 R18.1 78.52,68.77 CN12.4
  Bottom Layer w0.254: 74.92,69.98 v1(75.18,69.72) ; 74.92,69.98 v1(70.1,65.15) ; 74.92,69.98 74.92,74.17 CN11.4 ; v1(60.19,57.78) 59.94,58.04 55.87,58.04 53.33,55.5 v1(37.33,55.5) ; v1(34.37,52.96) 34.37,53.21 v1(35.64,54.48)
TRIG0: length 68.1
  Top Layer w0.254: R20.2 97.87,69.41 v1(97.87,65.4) ; v1(104.47,73.79) 104.47,74.83 Q1.2 ; v1(65.1,32.64) v1(87.46,54.99)
  Bottom Layer w0.254: v1(87.46,54.99) v1(97.87,65.4) 97.87,67.18 v1(104.47,73.79) ; U1.24 v1(65.1,32.64)
TRIG1: length 52.4
  Top Layer w0.254: Q3.2 104.51,59.96 101.22,56.67 R24.2 98.76,57.43 97.52,57.43 96.76,56.67 77.45,56.67 v1(66.37,45.59)
  Bottom Layer w0.254: U1.26 61.55,46.86 65.1,46.86 v1(66.37,45.59)
TRIG2: length 77
  Top Layer w0.254: Q5.2 120.36,60.13 118.43,58.2 116.91,58.2 R28.2 115.14,56.43 115.14,50.67 112.85,48.39 111.33,48.39 106,43.05 v1(97.62,43.05)
  Bottom Layer w0.254: U1.28 56.72,44.07 96.6,44.07 v1(97.62,43.05)
TRIG3: length 100.5
  Top Layer w0.254: Q7.2 120.36,74.21 121.22,73.35 121.22,72.59 120.97,72.34 116.65,72.34 R32.2 114.54,70.23 104.47,70.23 97.36,63.12 v1(96.6,63.12) ; v1(46.31,53.21) 41.99,53.21 39.19,50.42 39.19,49.91 U1.36
  Bottom Layer w0.254: v1(46.31,53.21) 86.69,53.21 v1(96.6,63.12)
TX1: length 27.9
  Top Layer w0.254: Q20.2 27.62,16.38 27.62,16.89 ; U1.3 20.14,19.68 27.11,19.68 27.62,19.18 27.62,16.89 ; 27.62,16.89 29.79,16.89 R43.1
TX4: length 89.3
  Bottom Layer w0.254: U6.4 99.91,42.04 98.38,40.51 54.69,40.51 50.88,44.32 46.56,44.32 44.28,42.04 30.81,42.04 U1.39
TX5: length 83.2
  Bottom Layer w0.254: U1.42 22.94,48.89 27.51,48.89 29.03,47.37 52.66,47.37 53.93,46.1 53.93,45.08 56.6,42.41 97.36,42.41 CN13.4
TX7: length 80
  Bottom Layer w0.254: U1.21 56.47,29.08 63.32,29.08 72.57,38.32 126.32,38.32 127.08,39.08 127.08,40.94 U5.4
$2N1400: length 45.9
  Top Layer w0.254: U2.4 39.34,57.38 v1(38.07,58.64) ; R1.2 9,69.75 CN14.4
  Bottom Layer w0.254: CN14.4 14.33,74.25 31.1,57.49 35.89,57.49 36.8,58.39 37.81,58.39 v1(38.07,58.64)
$2N1404: length 67.7
  Top Layer w0.254: R2.2 11,74.75 CN14.3 ; U2.5 40.01,58.03 38.48,59.55 v1(38.48,60.68) ; v1(43.89,70.15) 45.16,68.88 v1(45.16,67.86)
  Bottom Layer w0.254: v1(45.16,67.86) 38.48,61.19 v1(38.48,60.68) ; CN14.3 14.59,76.75 15.86,78.02 41.35,78.02 42.11,77.26 42.11,71.92 v1(43.89,70.15)
$2N1409: length 36.6
  Top Layer w0.254: R3.2 17,69.72 CN15.4 ; U2.6 40.19,58.67 39.1,59.77 v1(39.1,60.03)
  Bottom Layer w0.254: CN15.4 31.22,60.03 v1(39.1,60.03)
$2N1414: length 50.9
  Top Layer w0.254: U2.7 41.99,59.33 42.29,59.62 42.29,62.93 v1(41.78,63.43) ; v1(43.31,63.94) 42.55,64.7 40.22,64.7 v1(39.35,65.57) ; R4.2 18.7,75.05 CN15.3
  Bottom Layer w0.254: CN15.3 32.49,61.26 35.03,61.26 v1(39.35,65.57) ; v1(43.31,63.94) 42.29,63.94 v1(41.78,63.43)
$2N1419: length 28.1
  Top Layer w0.254: v1(33.89,64.85) 35.16,64.85 40.04,59.97 U2.8 ; R5.2 25,69.75 CN16.4
  Bottom Layer w0.254: v1(33.89,64.85) 25,73.74 CN16.4
$2N1424: length 32.2
  Top Layer w0.254: R6.2 27,74.75 CN16.3 ; v1(34.55,66.34) 34.55,66.08 39.88,60.75 40.9,60.75 U2.9
  Bottom Layer w0.254: CN16.3 34.55,67.2 v1(34.55,66.34)
$2N2020: length 28.5
  Top Layer w0.254: U2.14 33.73,61.92 33.2,62.45 33.2,62.96 v1(33.96,63.72) ; R15.1 43.29,68.87 43.29,74.46 CN18.3
  Bottom Layer w0.254: v1(33.96,63.72) 35.16,64.92 35.16,70.91 CN18.3
$2N2036: length 25.2
  Top Layer w0.254: CN19.4 49,69.56 R14.1 ; U2.15 36.03,61.28 v1(36.81,62.06)
  Bottom Layer w0.254: CN19.4 v1(36.81,62.06)
$2N2050: length 33.1
  Top Layer w0.254: CN19.3 51.39,74.36 R13.1 ; v1(37.57,61.19) 37.01,60.62 U2.16
  Bottom Layer w0.254: CN19.3 50.27,75.48 50.27,73.89 v1(37.57,61.19)
$2N2062: length 38.9
  Top Layer w0.254: v1(48.36,65.61) 40.62,65.61 v1(39.98,66.25) ; R12.1 57,69.75 CN20.4 ; U2.17 34.06,59.97 32.95,61.09 v1(32.95,61.86)
  Bottom Layer w0.254: CN20.4 v1(48.36,65.61) ; v1(39.98,66.25) 39.11,66.25 34.72,61.86 v1(32.95,61.86)
$2N2072: length 38.1
  Top Layer w0.254: v1(36.53,59.33) U2.18 ; R11.1 59,74.75 CN20.3
  Bottom Layer w0.254: v1(36.53,59.33) 39.58,59.33 CN20.3
$2N2080: length 46.9
  Top Layer w0.254: v1(37.75,57.77) 37.5,58.03 U2.20 ; R9.1 67.26,74.49 CN21.3
  Bottom Layer w0.254: v1(37.75,57.77) 46.02,57.77 CN21.3
$2N2083: length 62.5
  Top Layer w0.254: v1(31.22,69.68) 31.73,70.19 31.73,77.04 32.74,78.06 57.38,78.06 61.95,73.49 64.24,73.49 ; U2.19 34.9,58.76 34.01,58.76 32.23,60.53 32.23,64.09 33.76,65.61 v1(33.76,66.12) ; R10.1 64.24,68.87 64.24,73.49 ; 64.24,73.49 CN21.4
  Bottom Layer w0.254: v1(31.22,69.68) 31.22,68.66 v1(33.76,66.12)
$2N2247: length 20.2
  Top Layer w0.254: R16.1 41,69.55 CN18.4 ; v1(34.81,63.08) 34.81,62.75 U2.13
  Bottom Layer w0.254: v1(34.81,63.08) 35.67,63.94 35.67,68.92 CN18.4
$2N3196: length 24.2
  Top Layer w0.254: v1(35.79,72.47) 35.79,71.2 v1(38.33,68.66) ; CN17.4 33,69.75 R7.2 ; U2.10 40.01,61.28 37.32,63.96 v1(37.32,65.36)
  Bottom Layer w0.254: v1(37.32,65.36) 38.33,66.38 v1(38.33,68.66) ; v1(35.79,72.47) 34.02,74.25 CN17.4
$2N3204: length 18.9
  Top Layer w0.254: v1(36.3,67.86) 35.29,68.88 35.03,68.88 ; 35.03,68.88 35.03,74.72 CN17.3 ; 35.03,68.88 R8.2 ; U2.11 40.93,62.02 40.11,62.02 39.86,62.27 39.86,64.05 37.57,66.34 v1(37.57,66.59)
  Bottom Layer w0.254: v1(36.3,67.86) v1(37.57,66.59)
$4N429: length 13.1
  Top Layer w0.254: Q1.3 101.78,74.17 ; 101.78,74.17 99.52,76.43 R19.2 ; 101.78,74.17 101.96,74.17 SONAR0.3
$4N445: length 6.6
  Top Layer w0.254: Q2.2 108.63,74.94 R21.1 110.45,80.16 SONAR0.4
$4N1006: length 6.6
  Top Layer w0.254: Q4.2 108.63,60.55 R25.1 110.45,65.77 SONAR1.4
$4N1014: length 13.1
  Top Layer w0.254: 101.78,59.78 108.15,66.15 SONAR1.3 ; 101.78,59.78 Q3.3 ; 101.78,59.78 99.52,62.03 R23.2
$4N1413: length 13.1
  Top Layer w0.254: R27.2 115.38,62.03 117.64,59.78 ; Q5.3 117.64,59.78 ; 117.64,59.78 117.82,59.78 SONAR2.3
$4N1418: length 6.6
  Top Layer w0.254: Q6.2 124.49,60.55 R29.1 126.31,65.77 SONAR2.4
$4N1809: length 13.1
  Top Layer w0.254: Q7.3 117.64,74.17 ; 117.64,74.17 124.01,80.54 SONAR3.3 ; 117.64,74.17 115.38,76.43 R31.2
$4N1814: length 6.6
  Top Layer w0.254: SONAR3.4 126.31,80.16 R33.1 124.49,74.94 Q8.2
$5N1723: length 65
  Top Layer w0.254: 31.48,17.55 v1(30.97,18.06) ; 31.48,17.55 31.48,17.75 R42.2 ; 31.48,17.55 31.48,14.25 v1(33.26,12.47) ; 23.47,18.45 23.61,18.32 v1(25.89,18.32) ; 23.47,18.45 R44.2 ; 23.47,18.45 22.71,19.21 19.66,19.21 18.39,17.94 15.16,17.94 R46.2 ; v1(40.75,12.47) 40.24,12.98 40.24,17.77 R40.2
  Bottom Layer w0.254: U19.6 U19.4 U19.2 20.26,12.47 CN3.1 CN54.1 v1(33.26,12.47) CN2.1 v1(40.75,12.47) CN1.1 ; v1(25.89,18.32) 30.72,18.32 v1(30.97,18.06)
$5N2083: length 31.7
  Bottom Layer w0.254: H1.2 58.72,12.7 CN50.1 CN51.1 CN52.1 CN53.1
$5N8442: length 16
  Top Layer w0.254: v1(43.54,10.7) 43.54,14.4 R40.1 42.32,16.98 44.17,18.83
  Bottom Layer w0.254: CN1.3 v1(43.54,10.7)
$5N8911: length 16.5
  Top Layer w0.254: CN2.3 32.22,14.53 R42.1 32.98,16.98 v1(33.49,17.49) ; v1(34.5,18.51) 35.08,18.51 35.42,18.84
  Bottom Layer w0.254: v1(33.49,17.49) v1(34.5,18.51)
$5N9063: length 21.9
  Top Layer w0.254: CN54.3 30.72,8.66 24.11,8.66 23.35,9.43 23.35,14.51 v1(24.37,15.52) ; R44.1 23.54,17.05 v1(24.37,17.05) 24.88,17.55 26.15,17.55 26.68,18.09 26.68,18.84
  Bottom Layer w0.254: v1(24.37,15.52) v1(24.37,17.05)
$5N9217: length 24.4
  Top Layer w0.254: 13.96,16.79 13.96,11.97 15.73,10.19 21.83,10.19 CN3.3 ; 13.96,16.79 14.67,16.79 R46.1 ; 13.96,16.79 13.96,18.82 14.21,19.08 17.71,19.08 17.94,18.84
$5N9426: length 96.7
  Bottom Layer w0.254: P2.2 88.31,24.6 88.31,7.59 87.04,6.31 57.4,6.31 H1.3 53.59,5.04 17.91,5.04 U19.5

## Copper pours and planes (outline as drawn; the poured copper is in the pictures)
3.3V on Inner1: -1.4,91.78 136.78,91.78 136.78,-0.81 -1.4,-0.81
3.3V on Inner1: 136.02,-1.44 139.83,-1.44 139.83,-2.84 136.02,-2.84
3.3V on Inner1: -54.1,92.41 87.88,92.41 87.88,-5.25 -54.1,-5.25
GND on Inner2: -66.67,95.97 73.41,95.97 73.41,-0.68 -66.67,-0.68
GND on Inner2: -2.29,92.29 139.83,92.29 139.83,-2.46 -2.29,-2.46

## Text on the board
Top Silkscreen Layer: 5V | GND | RX1  0 | 3.3V | TX1  1 | CRX1 23 | OUT2  2 | CTX1 22 | LRCLK2  3 | RX5 21 | BCKL2  4 | TX5 20 | IN2  5 | SCL 19 | OUT1D  6 | SDA 18 | OUT1A  7 | TX4 17 | I2C RST  8 | RX4 16 | OUT1C  9 | ECHO3 15 | CS 10 | TRIIG3 14 | MOSI 11 | SCK/LED | MISO 12 | A17 41 | A10 | A16 40 | A11 25 | A15 39 | A12 26 | A14 | A13 27 | ECHO2 37 | RX7 28 | TRIG2 36 | TX7 29 | ECHO1 35 | CRX3 30 | TRIG1 34 | CTX3 31 | ECHO0 33 | TRIG0 32 | PWM / Custom / Power | GND + | 5V GND MOSI MISO SCK OUT1C | 5V GND MOSI MISO SCK CS | 3.3V GND CRX1 CTX1 | 5V GND TR EC | PWR / GND / PWM | PRG / ON | 3.3 / 5V / C | 5V / - / C | 3.3 / GND / SCL / SDA | 3.3 / GND / RX5 / TX5 | 3.3 / GND / RX4 / TX4 / CTX3 | 3.3 / GND / SIG | 3.3 / GND / RX7 / TX7 / CRX3 | Teensy Sensor Board V6.1 / ©2025 Wimble Roboics / All Rights Reserved
